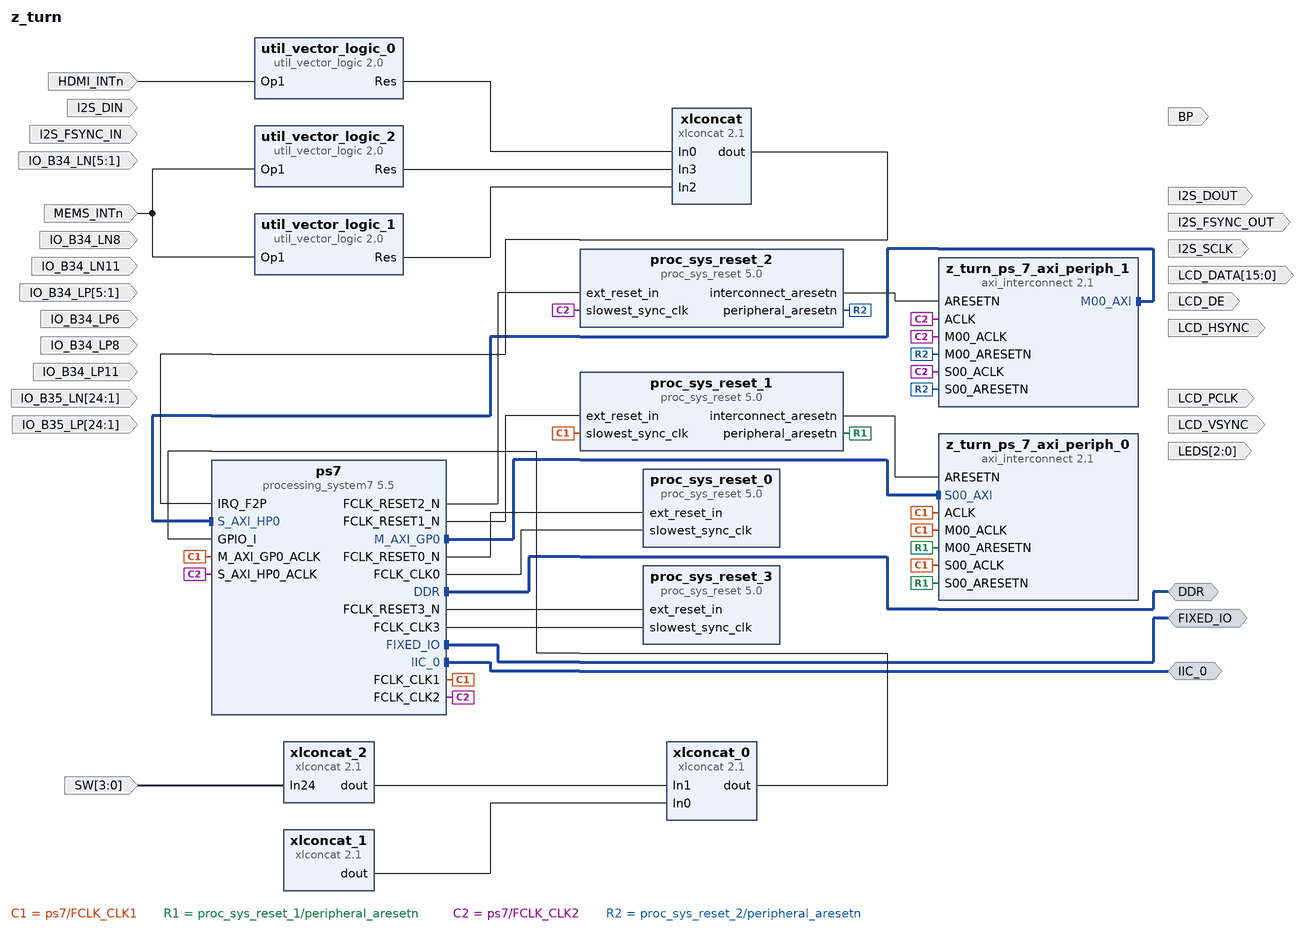
[diagram p0: block diagram of the top level]
# Vivado block design z_turn, Vivado 2015.2
create_bd_design z_turn

create_bd_intf_port -mode Master -vlnv xilinx.com:interface:ddrx_rtl:1.0 DDR
create_bd_intf_port -mode Master -vlnv xilinx.com:display_processing_system7:fixedio_rtl:1.0 FIXED_IO
create_bd_intf_port -mode Master -vlnv xilinx.com:interface:iic_rtl:1.0 IIC_0
create_bd_port -dir I -from 24 -to 1 -type data IO_B35_LP
create_bd_port -dir I -from 24 -to 1 -type data IO_B35_LN
create_bd_port -dir O -from 15 -to 0 -type data LCD_DATA
create_bd_port -dir O LCD_VSYNC
create_bd_port -dir O LCD_HSYNC
create_bd_port -dir O LCD_DE
create_bd_port -dir O -type clk LCD_PCLK
create_bd_port -dir O -type clk I2S_SCLK
create_bd_port -dir O I2S_FSYNC_OUT
create_bd_port -dir O I2S_DOUT
create_bd_port -dir I -from 5 -to 1 IO_B34_LP
create_bd_port -dir I -from 5 -to 1 IO_B34_LN
create_bd_port -dir I I2S_DIN
create_bd_port -dir I I2S_FSYNC_IN
create_bd_port -dir I IO_B34_LP6
create_bd_port -dir I IO_B34_LP8
create_bd_port -dir I IO_B34_LN8
create_bd_port -dir I -type clk IO_B34_LP11
set_property -dict {CONFIG.FREQ_HZ 50000000} [get_bd_ports IO_B34_LP11]
create_bd_port -dir I IO_B34_LN11
create_bd_port -dir O -from 2 -to 0 LEDS
create_bd_port -dir O BP
create_bd_port -dir I HDMI_INTn
create_bd_port -dir I MEMS_INTn
create_bd_port -dir I -from 3 -to 0 SW

create_bd_cell -type ip -vlnv xilinx.com:ip:proc_sys_reset:5.0 proc_sys_reset_2
create_bd_cell -type ip -vlnv xilinx.com:ip:proc_sys_reset:5.0 proc_sys_reset_3
create_bd_cell -type ip -vlnv xilinx.com:ip:proc_sys_reset:5.0 proc_sys_reset_0
create_bd_cell -type ip -vlnv xilinx.com:ip:processing_system7:5.5 ps7
set_property -dict [list \
  CONFIG.PCW_FPGA0_PERIPHERAL_FREQMHZ 166.667 \
  CONFIG.PCW_FPGA2_PERIPHERAL_FREQMHZ 100 \
  CONFIG.PCW_FPGA3_PERIPHERAL_FREQMHZ 200 \
  CONFIG.PCW_USE_S_AXI_HP0 1 \
  CONFIG.PCW_USE_FABRIC_INTERRUPT 1 \
  CONFIG.PCW_EN_CLK1_PORT 1 \
  CONFIG.PCW_EN_CLK2_PORT 1 \
  CONFIG.PCW_EN_CLK3_PORT 1 \
  CONFIG.PCW_EN_RST1_PORT 1 \
  CONFIG.PCW_EN_RST2_PORT 1 \
  CONFIG.PCW_EN_RST3_PORT 1 \
  CONFIG.PCW_IRQ_F2P_INTR 1 \
  CONFIG.PCW_PRESET_BANK1_VOLTAGE {LVCMOS 1.8V} \
  CONFIG.PCW_UIPARAM_DDR_PARTNO {MT41K256M16 RE-15E} \
  CONFIG.PCW_QSPI_PERIPHERAL_ENABLE 1 \
  CONFIG.PCW_QSPI_GRP_SINGLE_SS_ENABLE 1 \
  CONFIG.PCW_QSPI_GRP_FBCLK_ENABLE 1 \
  CONFIG.PCW_ENET0_PERIPHERAL_ENABLE 1 \
  CONFIG.PCW_ENET0_ENET0_IO {MIO 16 .. 27} \
  CONFIG.PCW_ENET0_GRP_MDIO_ENABLE 1 \
  CONFIG.PCW_ENET_RESET_ENABLE 0 \
  CONFIG.PCW_SD0_PERIPHERAL_ENABLE 1 \
  CONFIG.PCW_SD0_GRP_CD_ENABLE 1 \
  CONFIG.PCW_SD0_GRP_CD_IO {MIO 46} \
  CONFIG.PCW_SD0_GRP_WP_ENABLE 1 \
  CONFIG.PCW_SD0_GRP_WP_IO {MIO 47} \
  CONFIG.PCW_UART1_PERIPHERAL_ENABLE 1 \
  CONFIG.PCW_CAN0_PERIPHERAL_ENABLE 1 \
  CONFIG.PCW_CAN0_CAN0_IO {MIO 14 .. 15} \
  CONFIG.PCW_USB0_PERIPHERAL_ENABLE 1 \
  CONFIG.PCW_USB0_RESET_ENABLE 1 \
  CONFIG.PCW_USB0_RESET_IO {MIO 51} \
  CONFIG.PCW_I2C0_PERIPHERAL_ENABLE 1 \
  CONFIG.PCW_I2C1_PERIPHERAL_ENABLE 1 \
  CONFIG.PCW_I2C1_I2C1_IO {MIO 12 .. 13} \
  CONFIG.PCW_I2C_RESET_ENABLE 0 \
  CONFIG.PCW_GPIO_MIO_GPIO_ENABLE 1 \
  CONFIG.PCW_GPIO_EMIO_GPIO_ENABLE 1 \
] [get_bd_cells ps7]
# 6 more settings of ps7 are not shown: defaults, MIO pin electricals, DDR timing, and values the tool derives
create_bd_cell -type ip -vlnv xilinx.com:ip:axi_interconnect:2.1 z_turn_ps_7_axi_periph_0
set_property -dict {CONFIG.NUM_MI 1 CONFIG.S00_HAS_DATA_FIFO 0} [get_bd_cells z_turn_ps_7_axi_periph_0]
create_bd_cell -type ip -vlnv xilinx.com:ip:axi_interconnect:2.1 z_turn_ps_7_axi_periph_1
set_property -dict {CONFIG.NUM_MI 1 CONFIG.S00_HAS_DATA_FIFO 0} [get_bd_cells z_turn_ps_7_axi_periph_1]
create_bd_cell -type ip -vlnv xilinx.com:ip:proc_sys_reset:5.0 proc_sys_reset_1
create_bd_cell -type ip -vlnv xilinx.com:ip:util_vector_logic:2.0 util_vector_logic_0
set_property -dict {CONFIG.C_SIZE 1 CONFIG.C_OPERATION not} [get_bd_cells util_vector_logic_0]
create_bd_cell -type ip -vlnv xilinx.com:ip:util_vector_logic:2.0 util_vector_logic_1
set_property -dict {CONFIG.C_SIZE 1 CONFIG.C_OPERATION not} [get_bd_cells util_vector_logic_1]
create_bd_cell -type ip -vlnv xilinx.com:ip:util_vector_logic:2.0 util_vector_logic_2
set_property -dict {CONFIG.C_SIZE 1 CONFIG.C_OPERATION not} [get_bd_cells util_vector_logic_2]
create_bd_cell -type ip -vlnv xilinx.com:ip:xlconcat:2.1 xlconcat
set_property -dict {CONFIG.NUM_PORTS 16} [get_bd_cells xlconcat]
create_bd_cell -type ip -vlnv xilinx.com:ip:xlconcat:2.1 xlconcat_0
set_property -dict {CONFIG.IN0_WIDTH 32 CONFIG.IN1_WIDTH 32} [get_bd_cells xlconcat_0]
create_bd_cell -type ip -vlnv xilinx.com:ip:xlconcat:2.1 xlconcat_1
set_property -dict {CONFIG.NUM_PORTS 32} [get_bd_cells xlconcat_1]
create_bd_cell -type ip -vlnv xilinx.com:ip:xlconcat:2.1 xlconcat_2
set_property -dict {CONFIG.NUM_PORTS 29 CONFIG.IN24_WIDTH 4 CONFIG.IN28_WIDTH 1} [get_bd_cells xlconcat_2]

# ---- connections ----

connect_bd_intf_net -intf_net ps_7_M_AXI_GP0 [get_bd_intf_pins ps7/M_AXI_GP0] [get_bd_intf_pins z_turn_ps_7_axi_periph_0/S00_AXI]
connect_bd_intf_net -intf_net io2axis_M00_AXI [get_bd_intf_pins z_turn_ps_7_axi_periph_1/M00_AXI] [get_bd_intf_pins ps7/S_AXI_HP0]
connect_bd_intf_net -intf_net ps_7_DDR [get_bd_intf_ports DDR] [get_bd_intf_pins ps7/DDR]
connect_bd_intf_net -intf_net ps_7_FIXED_IO [get_bd_intf_ports FIXED_IO] [get_bd_intf_pins ps7/FIXED_IO]
connect_bd_intf_net [get_bd_intf_ports IIC_0] [get_bd_intf_pins ps7/IIC_0]
connect_bd_net -net xlconcat_0_dout [get_bd_pins xlconcat/dout] [get_bd_pins ps7/IRQ_F2P]
connect_bd_net -net ps_7_FCLK_CLK0 [get_bd_pins ps7/FCLK_CLK1] \
  [get_bd_pins ps7/M_AXI_GP0_ACLK] [get_bd_pins proc_sys_reset_1/slowest_sync_clk] \
  [get_bd_pins z_turn_ps_7_axi_periph_0/ACLK] [get_bd_pins z_turn_ps_7_axi_periph_0/S00_ACLK] \
  [get_bd_pins z_turn_ps_7_axi_periph_0/M00_ACLK]
connect_bd_net -net rst_ps_7_166M_peripheral_aresetn [get_bd_pins proc_sys_reset_1/peripheral_aresetn] \
  [get_bd_pins z_turn_ps_7_axi_periph_0/S00_ARESETN] [get_bd_pins z_turn_ps_7_axi_periph_0/M00_ARESETN]
connect_bd_net -net rst_ps_7_166M_interconnect_aresetn [get_bd_pins proc_sys_reset_1/interconnect_aresetn] \
  [get_bd_pins z_turn_ps_7_axi_periph_0/ARESETN]
connect_bd_net -net ps_7_FCLK_CLK2 [get_bd_pins ps7/FCLK_CLK2] \
  [get_bd_pins proc_sys_reset_2/slowest_sync_clk] [get_bd_pins ps7/S_AXI_HP0_ACLK] \
  [get_bd_pins z_turn_ps_7_axi_periph_1/ACLK] [get_bd_pins z_turn_ps_7_axi_periph_1/S00_ACLK] \
  [get_bd_pins z_turn_ps_7_axi_periph_1/M00_ACLK]
connect_bd_net -net ps_7_FCLK_RESET1_N [get_bd_pins ps7/FCLK_RESET1_N] [get_bd_pins proc_sys_reset_1/ext_reset_in]
connect_bd_net -net ps_7_FCLK_RESET2_N [get_bd_pins ps7/FCLK_RESET2_N] [get_bd_pins proc_sys_reset_2/ext_reset_in]
connect_bd_net -net proc_sys_reset2_interconnect_aresetn [get_bd_pins proc_sys_reset_2/interconnect_aresetn] \
  [get_bd_pins z_turn_ps_7_axi_periph_1/ARESETN]
connect_bd_net -net proc_sys_reset2_peripheral_aresetn [get_bd_pins proc_sys_reset_2/peripheral_aresetn] \
  [get_bd_pins z_turn_ps_7_axi_periph_1/S00_ARESETN] [get_bd_pins z_turn_ps_7_axi_periph_1/M00_ARESETN]
connect_bd_net -net ps_7_FCLK_RESET0_N [get_bd_pins ps7/FCLK_RESET0_N] [get_bd_pins proc_sys_reset_0/ext_reset_in]
connect_bd_net -net ps_7_FCLK_RESET3_N [get_bd_pins ps7/FCLK_RESET3_N] [get_bd_pins proc_sys_reset_3/ext_reset_in]
connect_bd_net -net ps_7_FCLK_CLK3 [get_bd_pins ps7/FCLK_CLK3] [get_bd_pins proc_sys_reset_3/slowest_sync_clk]
connect_bd_net -net ps_7_FCLK_CLK1 [get_bd_pins ps7/FCLK_CLK0] [get_bd_pins proc_sys_reset_0/slowest_sync_clk]
connect_bd_net [get_bd_pins util_vector_logic_0/Res] [get_bd_pins xlconcat/In0]
connect_bd_net [get_bd_ports HDMI_INTn] [get_bd_pins util_vector_logic_0/Op1]
connect_bd_net [get_bd_pins util_vector_logic_1/Res] [get_bd_pins xlconcat/In2]
connect_bd_net [get_bd_ports MEMS_INTn] [get_bd_pins util_vector_logic_1/Op1] [get_bd_pins util_vector_logic_2/Op1]
connect_bd_net [get_bd_pins util_vector_logic_2/Res] [get_bd_pins xlconcat/In3]
connect_bd_net [get_bd_pins xlconcat_1/dout] [get_bd_pins xlconcat_0/In0]
connect_bd_net [get_bd_pins xlconcat_2/dout] [get_bd_pins xlconcat_0/In1]
connect_bd_net [get_bd_pins xlconcat_0/dout] [get_bd_pins ps7/GPIO_I]
connect_bd_net [get_bd_ports SW] [get_bd_pins xlconcat_2/In24]

validate_bd_design
save_bd_design
